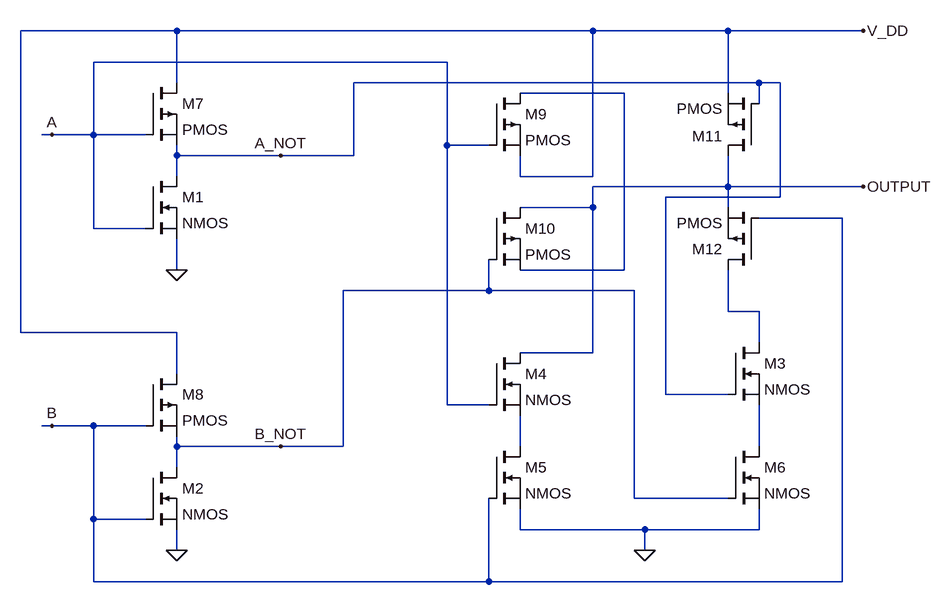
[diagram p0: schematic project4.asc]
project4.asc, the LTspice schematic file:
Version 4
SHEET 1 912 680
WIRE -256 -560 -496 -560
WIRE 384 -560 -256 -560
WIRE 592 -560 384 -560
WIRE 800 -560 592 -560
WIRE 160 -512 -384 -512
WIRE -256 -480 -256 -560
WIRE 640 -480 16 -480
WIRE 672 -480 640 -480
WIRE 432 -464 272 -464
WIRE 592 -464 592 -560
WIRE 640 -448 640 -480
WIRE -448 -400 -464 -400
WIRE -384 -400 -384 -512
WIRE -384 -400 -448 -400
WIRE -304 -400 -384 -400
WIRE 160 -384 160 -512
WIRE 224 -384 160 -384
WIRE -256 -368 -256 -384
WIRE -96 -368 -256 -368
WIRE 16 -368 16 -480
WIRE 16 -368 -96 -368
WIRE -256 -336 -256 -368
WIRE 272 -336 272 -368
WIRE 384 -336 384 -560
WIRE 384 -336 272 -336
WIRE 592 -320 592 -368
WIRE 592 -320 384 -320
WIRE 800 -320 592 -320
WIRE 672 -304 672 -480
WIRE 672 -304 496 -304
WIRE 384 -288 384 -320
WIRE 384 -288 272 -288
WIRE 592 -288 592 -320
WIRE 768 -272 640 -272
WIRE -384 -256 -384 -400
WIRE -304 -256 -384 -256
WIRE -256 -192 -256 -240
WIRE 432 -192 432 -464
WIRE 432 -192 272 -192
WIRE 224 -160 224 -208
WIRE 224 -160 0 -160
WIRE 448 -160 224 -160
WIRE 592 -128 592 -192
WIRE 640 -128 592 -128
WIRE -496 -96 -496 -560
WIRE -256 -96 -496 -96
WIRE 640 -80 640 -128
WIRE 384 -64 384 -288
WIRE 384 -64 272 -64
WIRE -256 -32 -256 -96
WIRE 496 0 496 -304
WIRE 592 0 496 0
WIRE 160 16 160 -384
WIRE 224 16 160 16
WIRE -448 48 -464 48
WIRE -384 48 -448 48
WIRE -304 48 -384 48
WIRE -256 80 -256 64
WIRE -96 80 -256 80
WIRE 0 80 0 -160
WIRE 0 80 -96 80
WIRE 272 80 272 32
WIRE 640 80 640 16
WIRE -256 112 -256 80
WIRE 448 160 448 -160
WIRE 592 160 448 160
WIRE -384 192 -384 48
WIRE -304 192 -384 192
WIRE 272 208 272 176
WIRE 464 208 272 208
WIRE 640 208 640 176
WIRE 640 208 464 208
WIRE -256 240 -256 208
WIRE 464 240 464 208
WIRE -384 288 -384 192
WIRE 224 288 224 160
WIRE 224 288 -384 288
WIRE 768 288 768 -272
WIRE 768 288 224 288
FLAG -256 240 0
FLAG -256 -192 0
FLAG -96 -368 A_NOT
FLAG -96 80 B_NOT
FLAG -448 48 B
FLAG -448 -400 A
FLAG 464 240 0
FLAG 800 -560 V_DD
FLAG 800 -320 OUTPUT
SYMBOL nmos -304 -336 R0
SYMATTR InstName M1
SYMBOL nmos -304 112 R0
SYMATTR InstName M2
SYMBOL nmos 592 -80 R0
SYMATTR InstName M3
SYMBOL nmos 224 -64 R0
SYMATTR InstName M4
SYMBOL nmos 224 80 R0
SYMATTR InstName M5
SYMBOL nmos 592 80 R0
SYMATTR InstName M6
SYMBOL pmos -304 -480 R0
SYMATTR InstName M7
SYMBOL pmos -304 -32 R0
SYMATTR InstName M8
SYMBOL pmos 224 -464 R0
SYMATTR InstName M9
SYMBOL pmos 224 -288 R0
SYMATTR InstName M10
SYMBOL pmos 640 -368 R180
WINDOW 0 56 30 Left 2
SYMATTR InstName M11
SYMBOL pmos 640 -192 R180
SYMATTR InstName M12

The netlist it stands for:
* project4.asc
M1 A_NOT A 0 0 NMOS
M2 B_NOT B 0 0 NMOS
M3 N002 A_NOT N004 N004 NMOS
M4 OUTPUT A N003 N003 NMOS
M5 N003 B 0 0 NMOS
M6 N004 B_NOT 0 0 NMOS
M7 V_DD A A_NOT A_NOT PMOS
M8 V_DD B B_NOT B_NOT PMOS
M9 N001 A V_DD V_DD PMOS
M10 OUTPUT B_NOT N001 N001 PMOS
M11 OUTPUT A_NOT V_DD V_DD PMOS
M12 N002 B OUTPUT OUTPUT PMOS
.model NMOS NMOS
.model PMOS PMOS
.lib standard.mos
.backanno
.end